# EAGLE design S65-Shield_v12 (EAGLE 6.6.0)
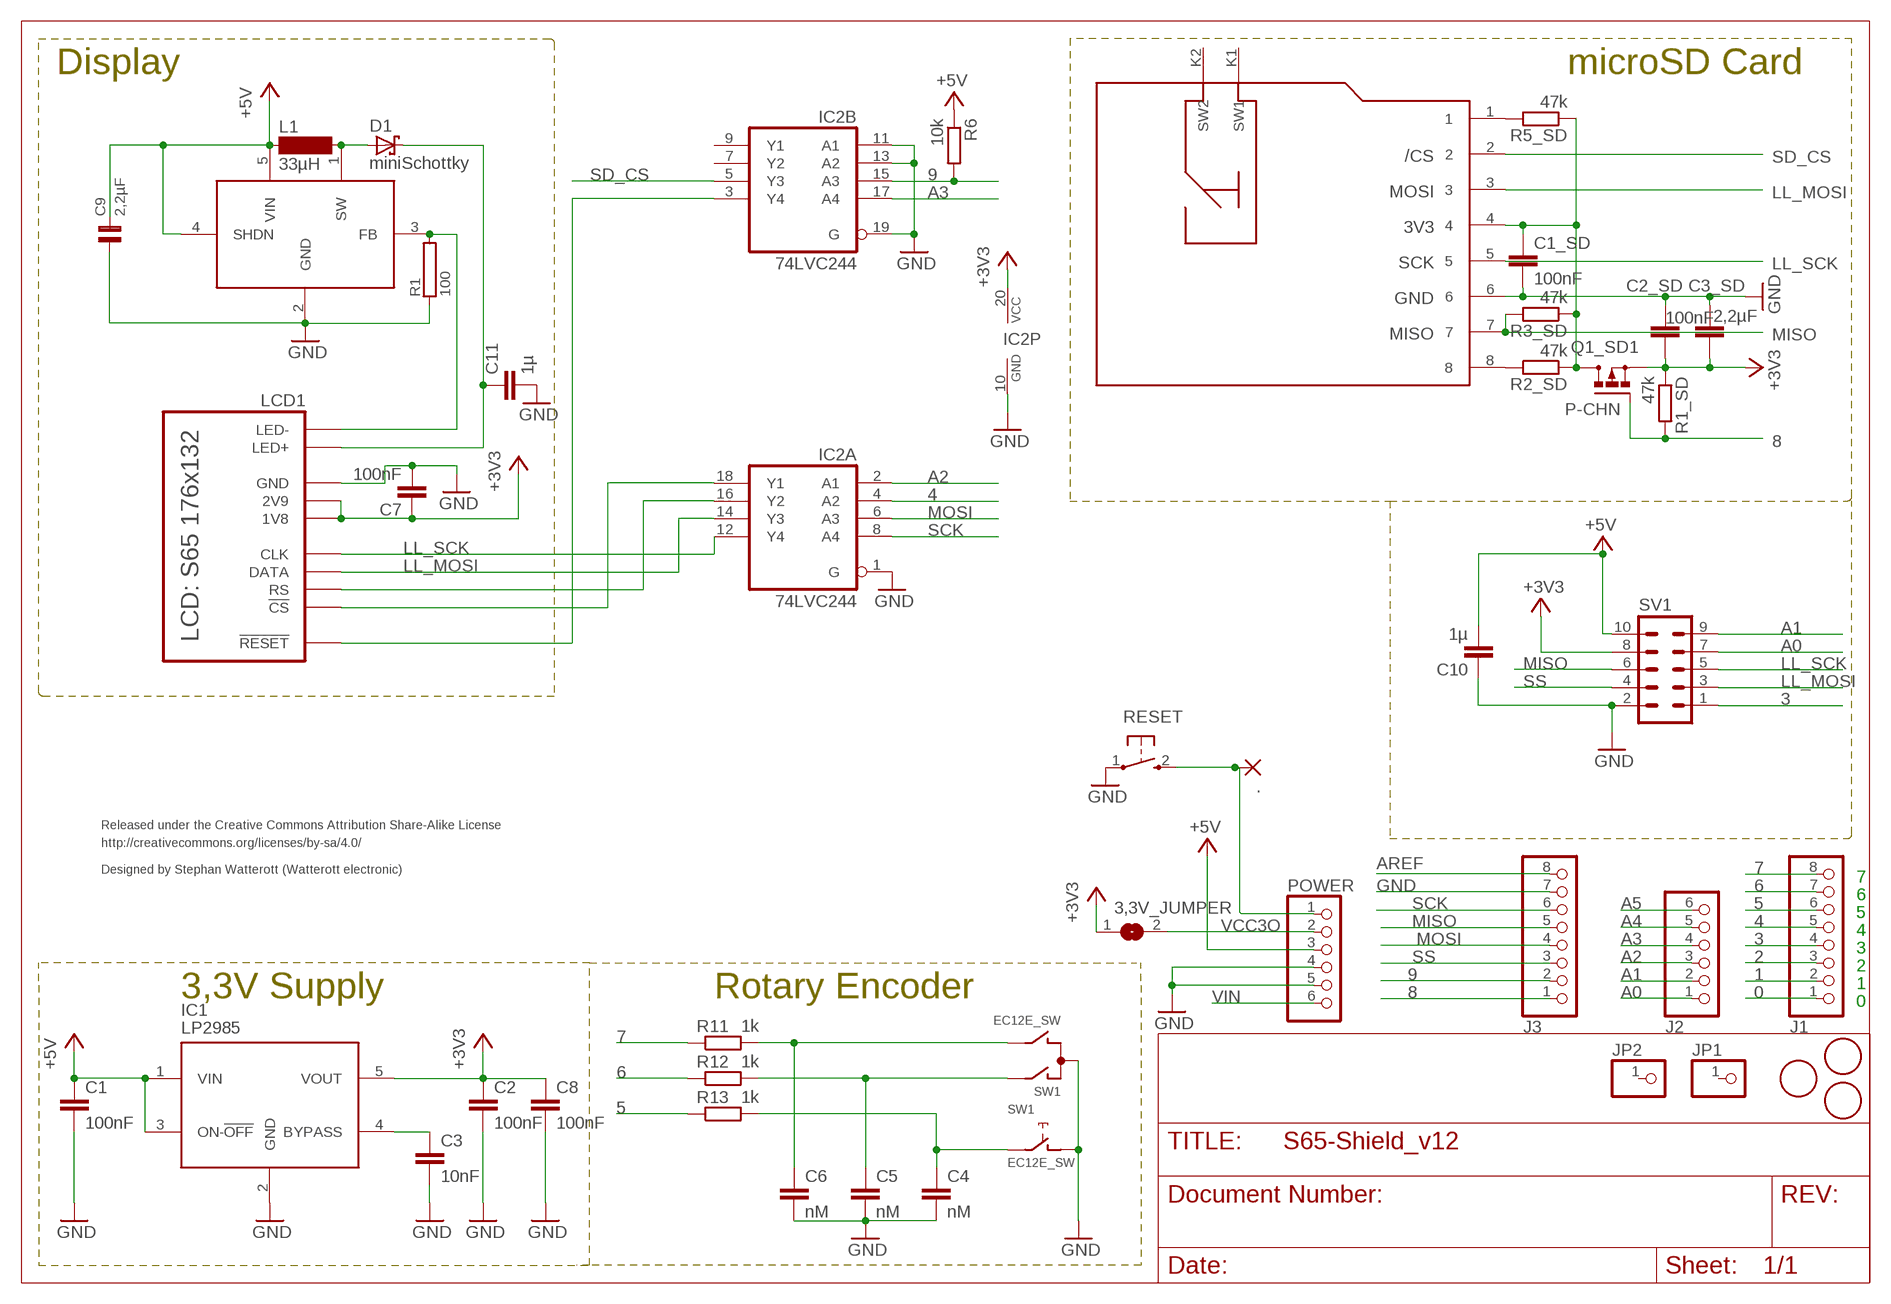
[diagram p0: schematic, sheet 1]

## Parts
3,3V_JUMPER  SJ  [SJ]
.  SMD2  [SMD1,27-2,54]
C1  100nF  C-EUC0603  [C0603]
C1_SD  100nF  C-EUC0603  [C0603]
C2  100nF  C-EUC0603  [C0603]
C2_SD  100nF  C-EUC0603  [C0603]
C3  10nF  C-EUC0603  [C0603]
C3_SD  2,2µF  C-EUC0805  [C0805]
C4  nM  C-EUC0603  [C0603]
C5  nM  C-EUC0603  [C0603]
C6  nM  C-EUC0603  [C0603]
C7  100nF  C-EUC0603  [C0603]
C8  100nF  C-EUC0805  [C0805]
C9  2,2µF  CAP0805  [0805]
C10  1µ  C-EUC0603  [C0603]
C11  1µ  C-EUC0603  [C0603]
D1  miniSchottky  DIODE0603  [D0603]
IC1  LP2985  [SOT23-5]
IC2  74LVC244  74AC244DW  [SO20W]
J1  PINHD-1X8  [1X08]
J2  PINHD-1X6  [1X06]
J3  PINHD-1X8  [1X08]
JP1  PINHD-1X1  [1X01]
JP2  PINHD-1X1  [1X01]
L1  33µH  MS42  [MS42]
LCD1  S65  [S65]
POWER  PINHD-1X6  [1X06]
Q1_SD1  P-CHN  IRLML6402  [MICRO3]
R1  100  R0603  [0603]
R1_SD  47k  R-EU_R0603  [R0603]
R2_SD  47k  R-EU_R0603  [R0603]
R3_SD  47k  R-EU_R0603  [R0603]
R5_SD  47k  R-EU_R0603  [R0603]
R6  10k  R-EU_R0603  [R0603]
R11  1k  R-EU_R0603  [R0603]
R12  1k  R-EU_R0603  [R0603]
R13  1k  R-EU_R0603  [R0603]
RESET  TAST_SMD1  [SMD_TASTER]
SD  MICRO-SD  [MICRO-SD]
SV1  ML10  [ML10]
SW1  EC12E_SW  [ALPS_EC12E_SW]
U$1  FIDUCIALMOUNT  [FIDUCIA-MOUNT]
U$2  FIDUCIALMOUNT  [FIDUCIA-MOUNT]
U$3  FIDUCIALMOUNT  [FIDUCIA-MOUNT]
U$4  LM2705  [SOT23-5]

## Nets
0: J1.1
1: J1.2
2: J1.3
3: J1.4 SV1.1
4: IC2.4(A:A2) J1.5
5: J1.6 R13.1
6: J1.7 R12.1
7: J1.8 R11.1
8: J3.1 Q1_SD1.1(G) R1_SD.2
9: IC2.15(B:A3) J3.2 R6.2
+3V3: 3,3V_JUMPER.1 C2.1 C2_SD.2 C3_SD.2 C7.1 C8.1 IC1.5(VOUT) IC2.20(P:VCC) LCD1.1V8 LCD1.2V9 Q1_SD1.2(S) R1_SD.1 SV1.8
+5V [usbvcc]: C1.1 C9.2 C10.2 IC1.1(VIN) IC1.3(ON-!OFF) L1.1 POWER.3 R6.1 SV1.10 U$4.4(SHDN) U$4.5(VIN)
A0: J2.1 SV1.7
A1: J2.2 SV1.9
A2: IC2.2(A:A1) J2.3
A3: IC2.17(B:A4) J2.4
A4: J2.5
A5: J2.6
AREF [aref]: J3.8
GND [gnd]: C1.2 C1_SD.2 C2.2 C2_SD.1 C3.2 C3_SD.1 C4.2 C5.2 C6.2 C7.2 C8.2 C9.1 C10.1 C11.2 IC1.2(GND) IC2.1(A:G) IC2.10(P:GND) IC2.11(B:A1) IC2.13(B:A2) IC2.19(B:G) J3.7 LCD1.GND POWER.4 POWER.5 R1.1 RESET.1(P) SD.6 SV1.2 SW1.C SW1.D U$4.2(GND)
LED+: C11.1 D1.1(C) LCD1.LED+
LED-: LCD1.LED- R1.2 U$4.3(FB)
LL_MOSI: IC2.14(A:Y3) LCD1.DATA SD.3 SV1.3
LL_SCK: IC2.12(A:Y4) LCD1.CLK SD.5 SV1.5
MISO: J3.5 R3_SD.2 SD.7 SV1.6
MOSI: IC2.6(A:A3) J3.4
N$1: R5_SD.2 SD.1
N$2: IC2.16(A:Y2) LCD1.RS
N$3: IC2.18(A:Y1) LCD1.CS(!CS)
N$4: IC2.3(B:Y4) LCD1.RESET(!RESET)
N$5: D1.2(A) L1.2 U$4.1(SW)
N$6: C4.1 R13.2 SW1.E
N$7: C5.1 R12.2 SW1.A
N$8: C6.1 R11.2 SW1.B
N$9: C3.1 IC1.4(BYPASS)
N$10: ..1(P) POWER.1 RESET.2(S)
N$15: R2_SD.2 SD.8
SCK: IC2.8(A:A4) J3.6
SD_3V3: C1_SD.1 Q1_SD1.3(D) R2_SD.1 R3_SD.1 R5_SD.1 SD.4
SD_CS: IC2.5(B:Y3) SD.2
SS: J3.3 SV1.4
VCC3O: 3,3V_JUMPER.2 POWER.2
VIN [power]: POWER.6
Unconnected: IC2.7(B:Y2) IC2.9(B:Y1) JP1.1 JP2.1 SD.K1(SW1) SD.K2(SW2) SW1.GND1(G) SW1.GND2(G)

## Notes on the sheet
- Display | microSD Card
- Released under the Creative Commons Attribution Share-Alike License
- http://creativecommons.org/licenses/by-sa/4.0/
- Designed by Stephan Watterott (Watterott electronic)
- 7
- 6
- 5
- 4
- 3
- 2
- 1
- 3,3V Supply | Rotary Encoder
- 0

## Library data of the parts
3,3V_JUMPER = jumper:SJ: SMD solder JUMPER
. = wirepad:SMD2: SMD PAD
C1-C8 C10 C11 = resistor:C-EU: CAPACITOR, European symbol
C1_SD C2_SD C3_SD = rcl:C-EU: CAPACITOR, European symbol
C9 = SMD:CAP0805
D1 = welectronic:DIODE0603
IC1 = Voltage-Reg:LP2985
IC2 = 74xx-eu:74*244: Octal BUFFER and LINE DRIVER, 3-state
J1 J3 = pinhead:PINHD-1X8: PIN HEADER
J2 POWER = pinhead:PINHD-1X6: PIN HEADER
JP1 JP2 = pinhead:PINHD-1X1: PIN HEADER
L1 = inductor-neosid:MS42: INDUCTOR SMD inductor
LCD1 = Display:S65
Q1_SD1 = IRF-sot23:IRLML6402: P-Channel Power MOSFET
R1 = SMD:R0603
R1_SD R2_SD R3_SD R5_SD = rcl:R-EU_: RESISTOR, European symbol
R6 R11-R13 = resistor:R-EU_: RESISTOR, European symbol
RESET = Taster:TAST_SMD1
SD = SD-Card:MICRO-SD
SV1 = con-ml:ML10: HARTING
SW1 = Encoder-IR:EC12E_SW: ALPS rotary Encoder EC12E series with switch
U$1-U$3 = SmartPrj:FIDUCIALMOUNT
U$4 = welectronic:LM2705

## Net classes
0 default: width 0.254 mm, drill 0.305 mm, clearance 0.152 mm
1 power: width 0.61 mm, drill 0.508 mm, clearance 0.152 mm
2 gnd: width 0.305 mm, drill 0.508 mm, clearance 0.152 mm
3 usbvcc: width 0.508 mm, drill 0.508 mm, clearance 0.152 mm
4 aref: width 0.406 mm

## Board
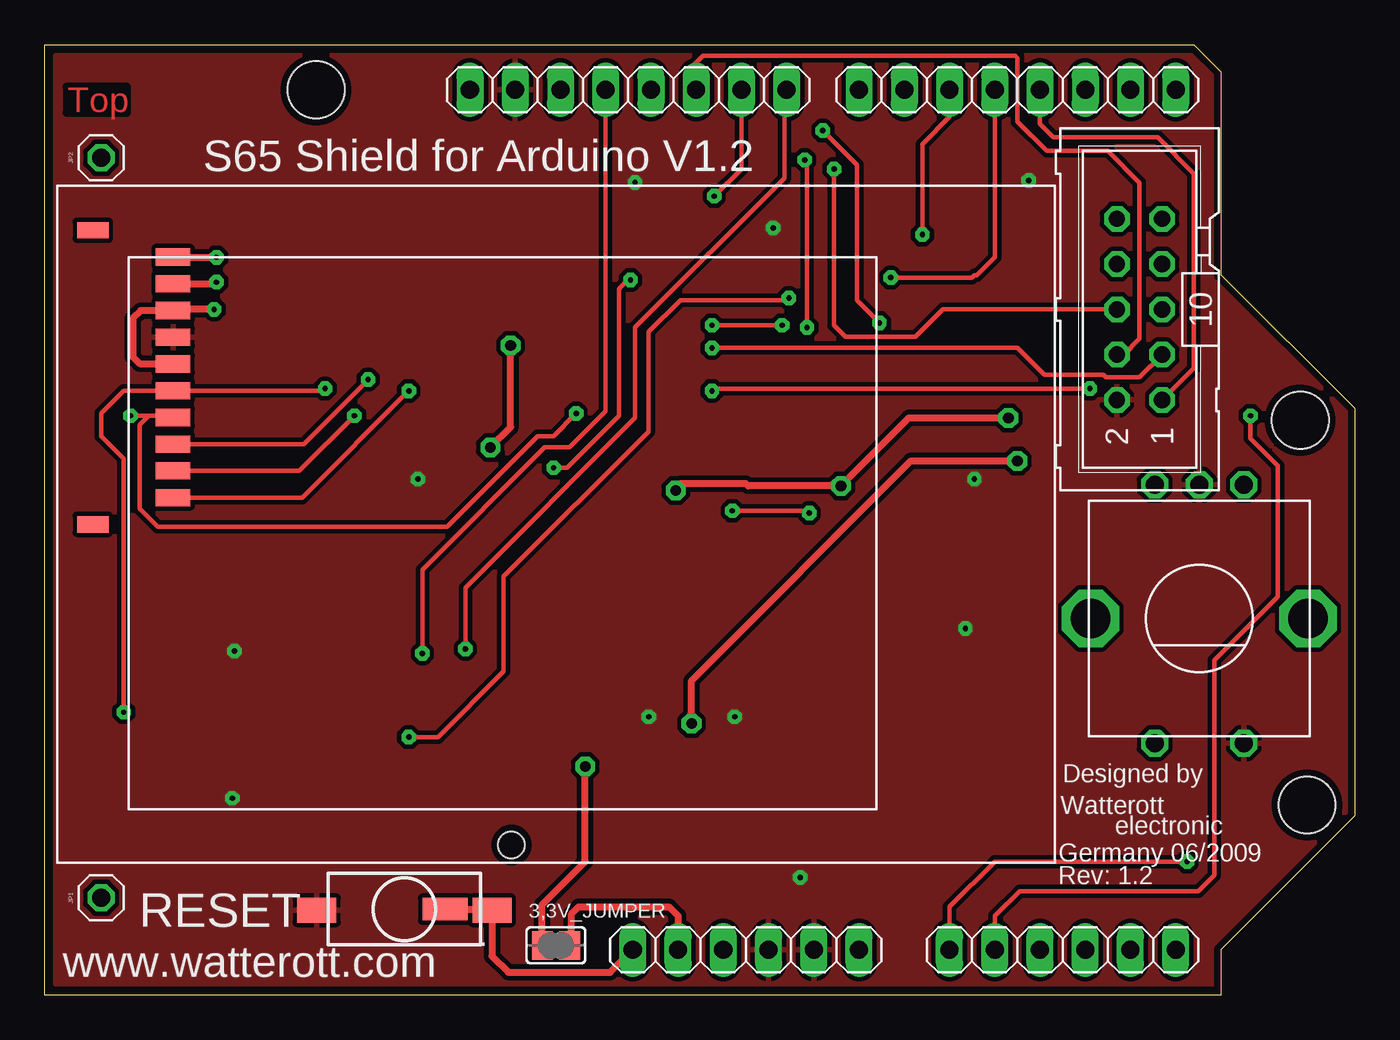
[diagram p1: board, top side]
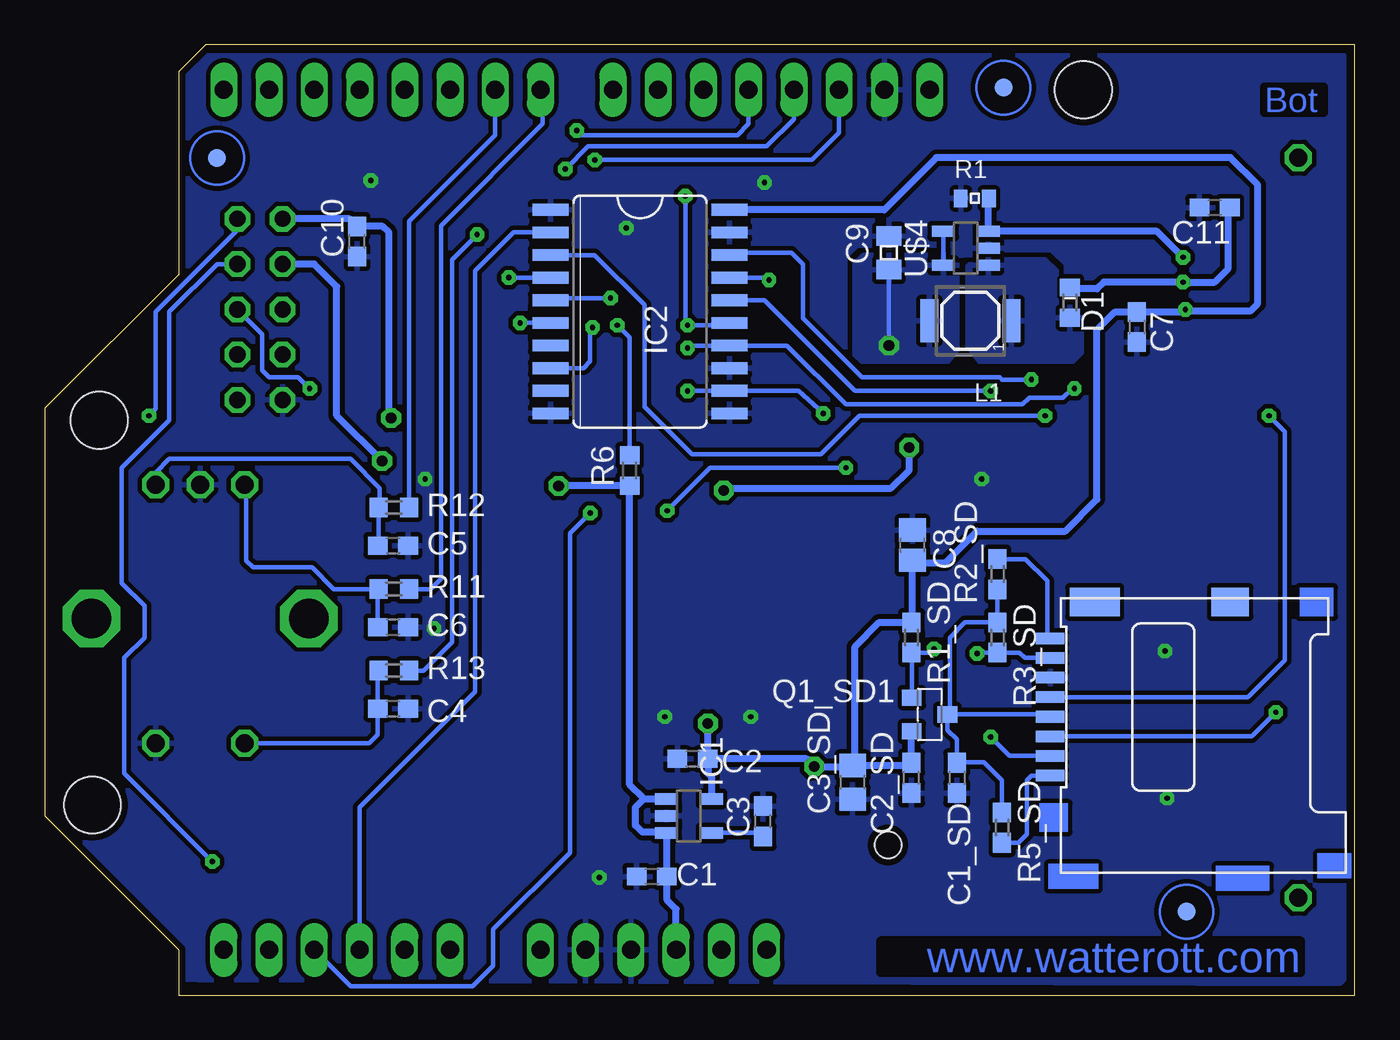
[diagram p2: board, bottom side, seen from below]

Size 73.56 x 53.34 mm. Coordinates in mm from the lower left corner, seen from the top.
Outline: 66.04,40.44 66.04,51.82 64.52,53.34 0,53.34 0,0 66.04,0 66.04,2.54 73.56,10.06 73.56,32.92 66.04,40.44
Outline: 66.04,40.44 66.04,40.39
Copper layers (1*16): Top 0.035mm / dielectric 1.5mm / Bottom 0.035mm
Design rules "default *": minimum track width 0.1499mm, minimum drill 0.27mm, track to track 6mil, track to pad 6mil, pad to pad 6mil, via to via 6mil, smd to smd 6mil, copper to edge 15mil, drill to drill 6mil, minimum pad ring 10mil, minimum via ring 10mil, stop-mask expansion 2mil, vias tented up to drill 0.8mm, thermal gap 10mil
Holes 3.2 mm at 70.48,32.26 70.87,10.67 15.24,50.8

### Footprints (pad centres in the part's own frame; a part is rotated, then mirrored left to right if it is on the bottom)
SJ = smd 1.168 x 1.6: 1 -0.762,0; 2 0.762,0
SMD1,27-2,54 = smd 1.27 x 2.54: 1 0,0
C0603 = smd 1.1 x 1: 1 -0.85,0; 2 0.85,0
C0805 = smd 1.3 x 1.5: 1 -0.95,0; 2 0.95,0
C0805' = smd 1.3 x 1.5: 1 -0.85,0; 2 0.85,0
0805 = smd 1.092 x 1.397: 1 -0.94,0; 2 0.94,0
D0603 = smd 1 x 1.1: 1 -0.85,0; 2 0.85,0
SOT23-5 = smd 0.635 x 1.27: 1 -0.953,-1.27; 2 0,-1.27; 3 0.953,-1.27; 4 0.953,1.27; 5 -0.953,1.27
SO20W = smd 0.66 x 2.032: 1 -5.715,-5.029; 2 -4.445,-5.029; 3 -3.175,-5.029; 4 -1.905,-5.029; 5 -0.635,-5.029; 6 0.635,-5.029; 7 1.905,-5.029; 8 3.175,-5.029; 9 4.445,-5.029; 10 5.715,-5.029; 11 5.715,5.029; 12 4.445,5.029; 13 3.175,5.029; 14 1.905,5.029; 15 0.635,5.029; 16 -0.635,5.029; 17 -1.905,5.029; 18 -3.175,5.029; 19 -4.445,5.029; 20 -5.715,5.029
1X08 = drill 1.016 long: 1 -8.89,0; 2 -6.35,0; 3 -3.81,0; 4 -1.27,0; 5 1.27,0; 6 3.81,0; 7 6.35,0; 8 8.89,0
1X06 = drill 1.016 long: 1 -6.35,0; 2 -3.81,0; 3 -1.27,0; 4 1.27,0; 5 3.81,0; 6 6.35,0
1X01 = drill 1.016 octagon: 1 0,0
MS42 = smd 2.4 x 1: 1 0,2.3; 2 0,-2.3
S65 = smd 1.93 x 0.965: 1V8 6.5,31; 2V9 6.5,28; CLK 6.5,25; CS 6.5,23.5; DATA 6.5,26.5; GND 6.5,29.5; LED+ 6.5,32.5; LED- 6.5,34; RESET 6.5,22; RS 6.5,20.5 | smd 1.778 x 0.914: NC1 2,19; NC2 2,35.5 | hole 1.5: 25.5,1
MICRO3 = smd 0.9 x 1.1: 1 -0.95,-1; 2 0.95,-1; 3 0,1
0603 = smd 0.762 x 0.965: 1 -0.787,0; 2 0.787,0
R0603 = smd 1.1 x 1: 1 -0.85,0; 2 0.85,0
R0603' = smd 1 x 1.1: 1 -0.85,0; 2 0.85,0
SMD_TASTER = smd 1.4 x 2.2: 1 0.318,-4.921; 2 0.318,4.921
MICRO-SD = smd 0.65 x 1.6: 1 -10.54,16.6; 2 -9.44,16.6; 3 -8.34,16.6; 4 -7.24,16.6; 5 -6.14,16.6; 6 -5.04,16.6; 7 -3.94,16.6; 8 -2.84,16.6 | smd 1.6 x 2.1: K1 -0.8,6.5 | smd 1.6 x 2.8: K2 -0.8,14.1
ML10 = drill 0.914 octagon: 1 -5.08,-1.27; 2 -5.08,1.27; 3 -2.54,-1.27; 4 -2.54,1.27; 5 0,-1.27; 6 0,1.27; 7 2.54,-1.27; 8 2.54,1.27; 9 5.08,-1.27; 10 5.08,1.27
ALPS_EC12E_SW = drill 1 octagon: A -2.5,-7.5; B 2.5,-7.5; C 0,-7.5; D -2.5,7; E 2.5,7 | drill 2.2 octagon: GND1 -6.1,0; GND2 6.1,0
FIDUCIA-MOUNT = smd 1.016 x 1.016: P$1 0,0

### Placement (x,y rotation side)
3,3V_JUMPER  28.7,2.79 0 top
.  22.48,4.83 90 top
C1  39.47,6.65 180 bottom
C1_SD  22.35,12.19 270 bottom
C2  37.19,13.26 180 bottom
C2_SD  24.89,12.19 90 bottom
C3  33.22,9.75 90 bottom
C3_SD  28.19,11.94 90 bottom
C4  54,16.08 0 bottom
C5  54,25.22 0 bottom
C6  54,20.65 0 bottom
C7  12.24,37.49 270 bottom
C8  100nF  [C0805']  24.84,25.25 90 bottom
C9  26.16,41.66 270 bottom
C10  56.01,42.29 90 bottom
C11  7.87,44.2 180 bottom
D1  16,38.86 270 bottom
IC1  37.39,10.06 270 bottom
IC2  40.13,38.35 270 bottom
J1  54.61,50.8 180 top
J2  57.15,2.54 0 top
J3  32.77,50.8 180 top
JP1  3.17,5.46 0 top
JP2  3.17,46.99 0 top
L1  21.59,37.85 90 bottom
LCD1  0.71,7.42 0 top
POWER  39.37,2.54 0 top
Q1_SD1  23.88,15.75 270 bottom
R1  21.34,44.7 0 bottom
R1_SD  24.89,20.07 270 bottom
R2_SD  20.07,23.62 90 bottom
R3_SD  20.07,20.07 270 bottom
R5_SD  19.81,9.4 270 bottom
R6  10k  [R0603']  40.72,29.44 90 bottom
R11  1k  [R0603']  53.95,22.78 180 bottom
R12  1k  [R0603']  53.95,27.36 180 bottom
R13  1k  [R0603']  53.95,18.21 180 bottom
RESET  20.19,5.08 270 top
SD  0.51,22.86 90 bottom
SV1  61.47,38.48 90 top
SW1  64.82,21.13 180 top
U$1  19.73,50.92 0 bottom
U$2  63.87,46.97 0 bottom
U$3  9.45,4.68 0 bottom
U$4  21.84,41.91 90 bottom

### Tracks (layer width: path | path; a pad name or v marks a point on that pad's centre or on a via)
3
  Top 0.254: J1.4 55.88,48.9 56.64,48.13 62.48,48.13 64.52,46.1 64.52,35.18 SV1.1
4  (via drill 0.3)
  Top 0.254: J1.5 53.34,41.4 52.32,40.39 52.2,40.39 52.07,40.26 v47.5,40.26
  Bottom 0.254: IC2.4 v47.5,40.26
5  (via drill 0.3)
  Top 0.254: v49.28,42.67 49.28,47.75 50.8,49.28 J1.6
  Bottom 0.254: R13.1 52.27,18.21 50.67,19.81 50.67,41.27 v49.28,42.67
6
  Bottom 0.254: R12.1 53.1,43.42 48.26,48.26 J1.7
7
  Bottom 0.254: J1.8 45.59,50.67 45.59,48.9 51.31,43.18 51.31,23.37 51.89,22.78 R11.1
8  (via drill 0.3)
  Top 0.254: J3.1 41.53,50.67 41.53,45.85 33.15,37.47 33.15,32.38 23.62,22.86 v23.62,19.43
  Bottom 0.254: Q1_SD1.1 24.88,19.2 R1_SD.2 23.84,19.22 v23.62,19.43
9  (via drill 0.3)
  Top 0.254: v41.4,37.59 v37.47,37.59 | J3.2 39.12,46.35 v37.59,44.83
  Bottom 0.254: R6.2 40.72,36.91 v41.4,37.59 | IC2.15 35.23,37.59 v37.47,37.59 37.59,37.72 v37.59,44.83
+3V3  (via drill 0.3, 0.6)
  Top 0.406: v9.53,38.48 7.28,38.48 LCD1.1V8 5.4,38.42 4.95,37.97 4.95,35.81 5.33,35.43 7.2,35.43 LCD1.2V9 | v54.61,29.97 48.64,29.97 36.32,17.65 v36.32,15.24 | 3,3V_JUMPER.1 27.94,5.08 30.35,7.49 v30.35,12.83
  Bottom 0.406: Q1_SD1.2 24.89,14.78 C2_SD.2 25.05,12.89 C3_SD.2 | C2.1 30.79,13.26 30.61,13.08 v30.35,12.83 28.25,12.83 C3_SD.2 | IC1.5 36.12,12.24 36.32,12.45 36.32,13.24 C2.1 | C3_SD.2 28.07,13.02 28.07,19.56 26.71,20.92 R1_SD.1 24.84,20.97 C8.1 24.7,24.26 22.99,24.26 21.21,26.04 16.26,26.04 14.48,27.81 14.48,37.34 13.48,38.34 C7.1 9.67,38.34 v9.53,38.48 9.46,38.42 5.84,38.42 5.46,38.8 5.46,45.47 6.99,46.99 23.5,46.99 26.42,44.07 IC2.20 | SV1.8 58.42,41.02 57.15,39.75 57.15,32.51 v54.61,29.97 | v36.32,15.24 36.32,13.27 C2.1
+5V  (via drill 0.6)
  Top 0.406: v54.1,32.38 48.51,32.38 v44.7,28.57 39.5,28.57 39.37,28.7 35.69,28.7 35.43,28.45 v35.43,28.32 | v26.16,36.45 26.16,31.88 v25.02,30.73
  Bottom 0.254: U$4.4 U$4.5 | v26.16,36.45 C9.2
  Bottom 0.406: POWER.3 38.1,4.83 38.61,5.33 38.61,6.64 C1.1 38.62,9.07 IC1.3 38.7,9.14 40.01,9.14 40.39,9.53 40.39,10.54 39.92,11.01 | 39.92,11.01 IC1.1 | 39.92,11.01 40.72,11.81 R6.1 40.73,28.57 v44.7,28.57 | SV1.10 56.43,43.56 C10.2 54.57,43.14 54.23,42.8 54.23,32.51 v54.1,32.38 | v25.02,30.73 25.02,29.46 26.04,28.45 35.31,28.45 v35.43,28.32
  pour Bottom: 27.56,41.53 22.48,41.53 22.35,41.27 22.35,36.2 22.86,35.56 27.69,35.56 28.07,35.94 28.07,41.02
A0  (via drill 0.3)
  Top 0.254: v64.14,7.49 53.34,7.49 50.8,4.95 J2.1
  Bottom 0.254: SV1.7 63.88,41.02 66.55,38.35 66.55,32.26 69.22,29.59 69.22,23.11 67.94,21.84 67.94,20.07 69.09,18.92 69.09,12.45 v64.14,7.49
A1  (via drill 0.3)
  Top 0.254: v67.69,32.51 67.69,31.24 69.22,29.72 69.22,22.35 65.66,18.8 65.66,6.73 64.77,5.84 54.74,5.84 53.34,4.45 J2.2
  Bottom 0.254: SV1.9 62.74,42.93 67.31,38.35 67.31,32.89 v67.69,32.51
A2
  Bottom 0.254: IC2.2 47.24,42.8 49.4,40.64 49.4,17.02 55.88,10.54 55.88,3.43 56.01,3.3 56.01,2.67 J2.3
A3  (via drill 0.3)
  Top 0.254: v32.89,40.13 32.77,40.13 32.26,39.62 32.26,32.51 29.34,29.59 v28.57,29.59 | v38.61,27.18 42.8,27.18 v42.93,27.05
  Bottom 0.254: IC2.17 33.02,40.26 v32.89,40.13 | v28.57,29.59 36.2,29.59 v38.61,27.18 | v42.93,27.05 44.07,25.91 44.07,8 48.39,3.68 48.39,1.65 49.53,0.51 56.39,0.51 J2.4
GND  (via drill 0.3)
  other vias: 33.91,15.62 38.73,15.62 42.42,6.6 55.24,45.72 40.89,43.05 33.15,45.59 20.95,28.96 10.67,19.3 10.54,11.05 52.2,28.96 51.69,20.57
  pour Bottom (isolate 0.254, rank 2): 0.64,52.7 73.03,52.7 73.03,0.89 0.89,0.64 0.64,0.89
  pour Top (isolate 0.254, rank 2): 0.64,52.7 73.03,52.7 73.03,0.64 0.64,0.64
LED+  (via drill 0.3)
  Top 0.406: LCD1.LED+ 9.56,39.92 v9.65,40.01
  Bottom 0.406: C11.1 7.11,44.11 7.11,40.77 7.87,40.01 v9.65,40.01 14.1,40.01 14.48,39.62 15.91,39.62 D1.1
LED-  (via drill 0.3)
  Top 0.406: v9.65,41.4 7.23,41.4 LCD1.LED-
  Bottom 0.406: R1.2 20.57,44.68 U$4.3 11.11,42.86 v9.65,41.4
LL_MOSI  (via drill 0.3)
  Top 0.254: v15.75,34.04 15.63,33.92 LCD1.DATA 7.2,33.91 4.45,33.91 3.17,32.64 3.17,31.37 4.45,30.1 v4.45,15.88 | v37.47,36.32 54.61,36.32 56.13,34.8 59.44,34.8 59.56,34.67 61.47,34.67 SV1.3
  Bottom 0.254: v15.75,34.04 15.88,34.04 16.38,33.53 18.29,33.53 18.67,33.15 28.57,33.15 31.88,36.45 IC2.14 37.34,36.45 v37.47,36.32 | SD.3 5.8,14.52 v4.45,15.88
LL_SCK  (via drill 0.3)
  Top 0.254: v4.83,32.51 5.84,32.51 | 5.84,32.51 7.12,32.51 LCD1.CLK | v37.47,33.91 37.59,34.04 v58.67,34.04 | 5.84,32.51 5.33,32 5.33,27.3 6.35,26.29 22.61,26.29 27.69,31.37 28.57,31.37 v29.84,32.64
  Bottom 0.254: SD.5 6.01,16.72 3.94,18.8 3.94,31.62 v4.83,32.51 | v37.47,33.91 IC2.12 31.24,33.91 v29.84,32.64 | v58.67,34.04 59.31,34.67 60.96,34.67 61.34,35.05 61.34,37.08 SV1.5
MISO  (via drill 0.3)
  Top 0.254: J3.5 31.5,32.77 29.46,30.73 28.07,30.73 21.21,23.88 v21.21,19.18 | SV1.6 50.42,38.48 48.9,36.96 44.96,36.96 44.32,37.59 v44.32,46.35
  Bottom 0.254: SD.7 18.54,18.92 18.84,19.22 R3_SD.2 21.17,19.22 v21.21,19.18 | v44.32,46.35 43.05,47.62 33.02,47.62 31.5,49.15 J3.5
MOSI  (via drill 0.3)
  Top 0.254: v43.69,48.51 43.81,48.39 45.59,46.61 45.59,38.99 v46.86,37.72
  Bottom 0.254: IC2.6 v46.86,37.72 | J3.4 34.04,48.9 34.67,48.26 43.43,48.26 v43.69,48.51
N$1
  Bottom 0.254: R5_SD.2 18.88,8.55 18.41,9.02 18.41,12.06 18.16,12.32 SD.1
N$2  (via drill 0.3)
  Top 0.254: LCD1.RS 14.46,27.92 v20.45,33.91 20.57,34.04
  Bottom 0.254: v20.45,33.91 28.07,33.91 33.15,38.99 IC2.16
N$3  (via drill 0.3)
  Top 0.254: LCD1.CS 14.53,30.92 v18.16,34.54
  Bottom 0.254: IC2.18 34.98,41.66 31.62,41.66 30.99,41.02 30.99,37.97 27.69,34.67 19.94,34.67 19.81,34.54 v18.16,34.54
N$4  (via drill 0.3)
  Top 0.254: LCD1.RESET 14.3,29.42 v17.4,32.51
  Bottom 0.254: v17.4,32.51 27.81,32.51 29.97,30.35 37.21,30.35 39.88,33.02 39.88,38.73 42.67,41.53 IC2.3
N$5
  pour Bottom: 17.4,41.27 21.34,41.27 21.72,40.89 21.72,36.45 21.08,35.56 15.88,35.56 15.37,36.07 15.37,38.23 15.75,38.61 16.76,38.61 16.76,40.64
N$6
  Bottom 0.254: SW1.E 55.34,14.13 54.86,14.61 54.86,16.07 C4.1 54.85,18.16 R13.2
N$7
  Bottom 0.254: C5.1 54.8,25.27 R12.2 54.74,27.42 54.74,28.45 56.39,30.1 66.55,30.1 67.32,29.33 SW1.A
N$8
  Bottom 0.254: C6.1 54.85,22.73 R11.2 57.33,22.78 58.55,24 61.85,24 62.23,24.38 62.23,28.54 SW1.B
N$9
  Bottom 0.254: IC1.4 33.42,9.11 C3.1
N$10
  Top 0.406: ..1 25.05,4.83 RESET.2 25.11,2.19 26.04,1.27 31.75,1.27 POWER.1
N$15
  Bottom 0.254: R2_SD.2 18.5,24.47 17.27,23.24 17.27,20.18 SD.8
SCK  (via drill 0.3)
  Top 0.254: v42.8,37.47 42.8,46.74 v42.67,46.86
  Bottom 0.254: IC2.8 43.31,35.18 42.93,35.56 42.93,37.34 v42.8,37.47 | v42.67,46.86 30.48,46.86 28.96,48.39 J3.6
SD_3V3
  Bottom 0.254: R2_SD.1 R3_SD.1 21.88,20.92 22.73,20.07 22.73,15.89 Q1_SD1.3 | Q1_SD1.3 17.24,15.75 SD.4 | R5_SD.1 19.81,12.06 20.83,13.08 22.31,13.08 C1_SD.1 22.35,14.35 22.88,14.88 Q1_SD1.3
SD_CS  (via drill 0.3)
  Top 0.254: v20.45,14.48 22.1,14.48 25.78,18.16 25.78,23.5 33.91,31.62 33.91,37.21 35.69,38.99 41.66,38.99 v41.78,39.12
  Bottom 0.254: SD.2 19.39,13.42 v20.45,14.48 | v41.78,39.12 45.03,39.12 IC2.5
SS
  Top 0.254: SV1.4 60.58,35.94 61.47,36.83 61.47,45.59 59.69,47.37 56.26,47.37 54.61,49.02 54.61,52.58 54.48,52.7 36.96,52.7 36.45,52.2 36.45,50.93 J3.3
VCC3O
  Top 0.406: POWER.2 35.56,4.45 35.05,4.95 29.97,4.95 29.59,4.57 29.59,2.92 3,3V_JUMPER.2

### Text on the board
Top: Top
Bottom: Bot | www.watterott.com
tPlace: www.watterott.com
tNames: S65 Shield for Arduino V1.2 | Designed by | Watterott | electronic | Germany 06/2009 | Rev: 1.2